# EAGLE design czujnik smrodu esp v02 (EAGLE 8.6.0)
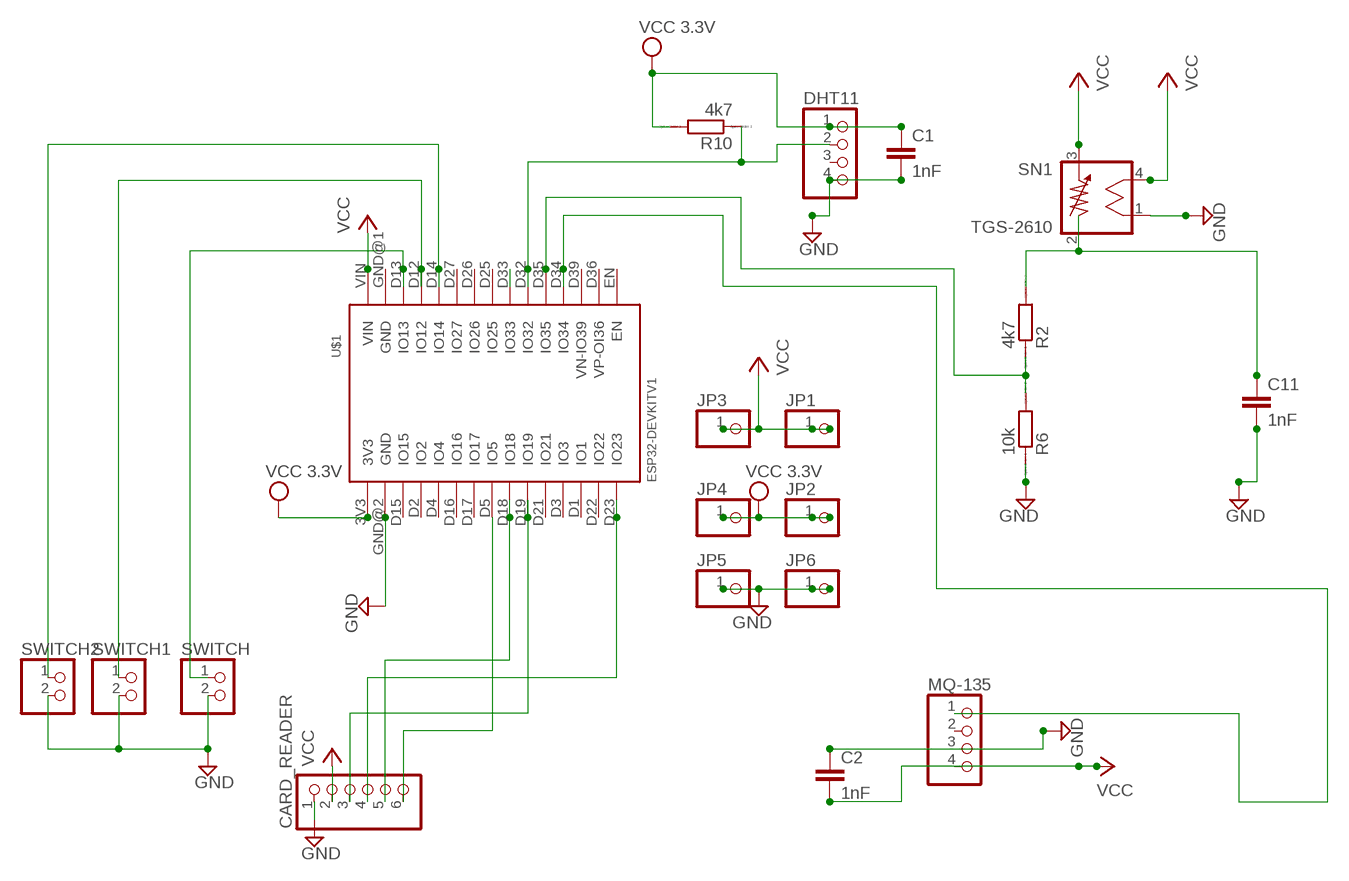
[diagram p0: schematic, sheet 1]

## Parts
C1  1nF  C2,5-3  [C2.5-3]
C2  1nF  C2,5-3  [C2.5-3]
C11  1nF  C2,5-3  [C2.5-3]
CARD_READER  PINHD-1X6  [1X06]
DHT11  PINHD-1X4  [1X04]
JP1  PINHD-1X1  [1X01]
JP2  PINHD-1X1  [1X01]
JP3  PINHD-1X1  [1X01]
JP4  PINHD-1X1  [1X01]
JP5  PINHD-1X1  [1X01]
JP6  PINHD-1X1  [1X01]
MQ-135  PINHD-1X4  [1X04]
R2  4k7  R0207/10  [0207/10]
R6  10k  R0207/10  [0207/10]
R10  4k7  R0207/10  [0207/10]
SN1  TGS-2610  [TGS-2610]
SWITCH  PINHD-1X2  [1X02]
SWITCH1  PINHD-1X2  [1X02]
SWITCH2  PINHD-1X2  [1X02]
U$1  ESP32DEVKITV1  [ESP32-DEVKITV1]

## Nets
CS: CARD_READER.6 U$1.D5(IO5)
GND: C1.2 C2.1 C11.2 CARD_READER.1 DHT11.4 JP5.1 JP6.1 MQ-135.3 R6.1 SN1.1 SWITCH1.2 SWITCH2.2 SWITCH.2 U$1.GND@2(GND)
MQ135_AIN: MQ-135.1 U$1.D34(IO34)
N$3: SWITCH1.1 U$1.D12(IO12)
N$4: R2.1 R6.2 U$1.D35(IO35)
N$5: SWITCH.1 U$1.D13(IO13)
N$10: U$1.D33(IO33)
N$14: CARD_READER.3 U$1.D19(IO19)
N$15: CARD_READER.4 U$1.D23(IO23)
N$16: DHT11.2 R10.1 U$1.D32(IO32)
N$17: CARD_READER.5 U$1.D18(IO18)
TGS2603_AIN: C11.1 R2.2 SN1.2
TX: SWITCH2.1 U$1.D14(IO14)
VCC: C1.1 C2.2 CARD_READER.2 DHT11.1 JP1.1 JP2.1 JP3.1 JP4.1 MQ-135.4 R10.2 SN1.3 SN1.4 U$1.3V3 U$1.VIN ; supply symbol labelled VCC 3.3V
Unconnected: DHT11.3 MQ-135.2 U$1.D1(IO1) U$1.D2(IO2) U$1.D3(IO3) U$1.D4(IO4) U$1.D15(IO15) U$1.D16(IO16) U$1.D17(IO17) U$1.D21(IO21) U$1.D22(IO22) U$1.D25(IO25) U$1.D26(IO26) U$1.D27(IO27) U$1.D36(VP-OI36) U$1.D39(VN-IO39) U$1.EN U$1.GND@1(GND)

## Library data of the parts
C1 C2 C11 = capacitor-wima:C: CAPACITOR naming: grid - package width
CARD_READER = pinhead:PINHD-1X6: PIN HEADER
DHT11 MQ-135 = pinhead:PINHD-1X4: PIN HEADER
JP1-JP6 = pinhead:PINHD-1X1: PIN HEADER
R2 R6 R10 = eagle-ltspice:R: RESISTOR, European symbol; SPICEMODEL: NONE; SPICEPREFIX: R
SN1 = figaro:TGS-2610: SENSOR TGS 2610 - Gas Sensor
SWITCH SWITCH1 SWITCH2 = pinhead:PINHD-1X2: PIN HEADER
U$1 = ESP32-DEVKITV1:ESP32DEVKITV1

## Board
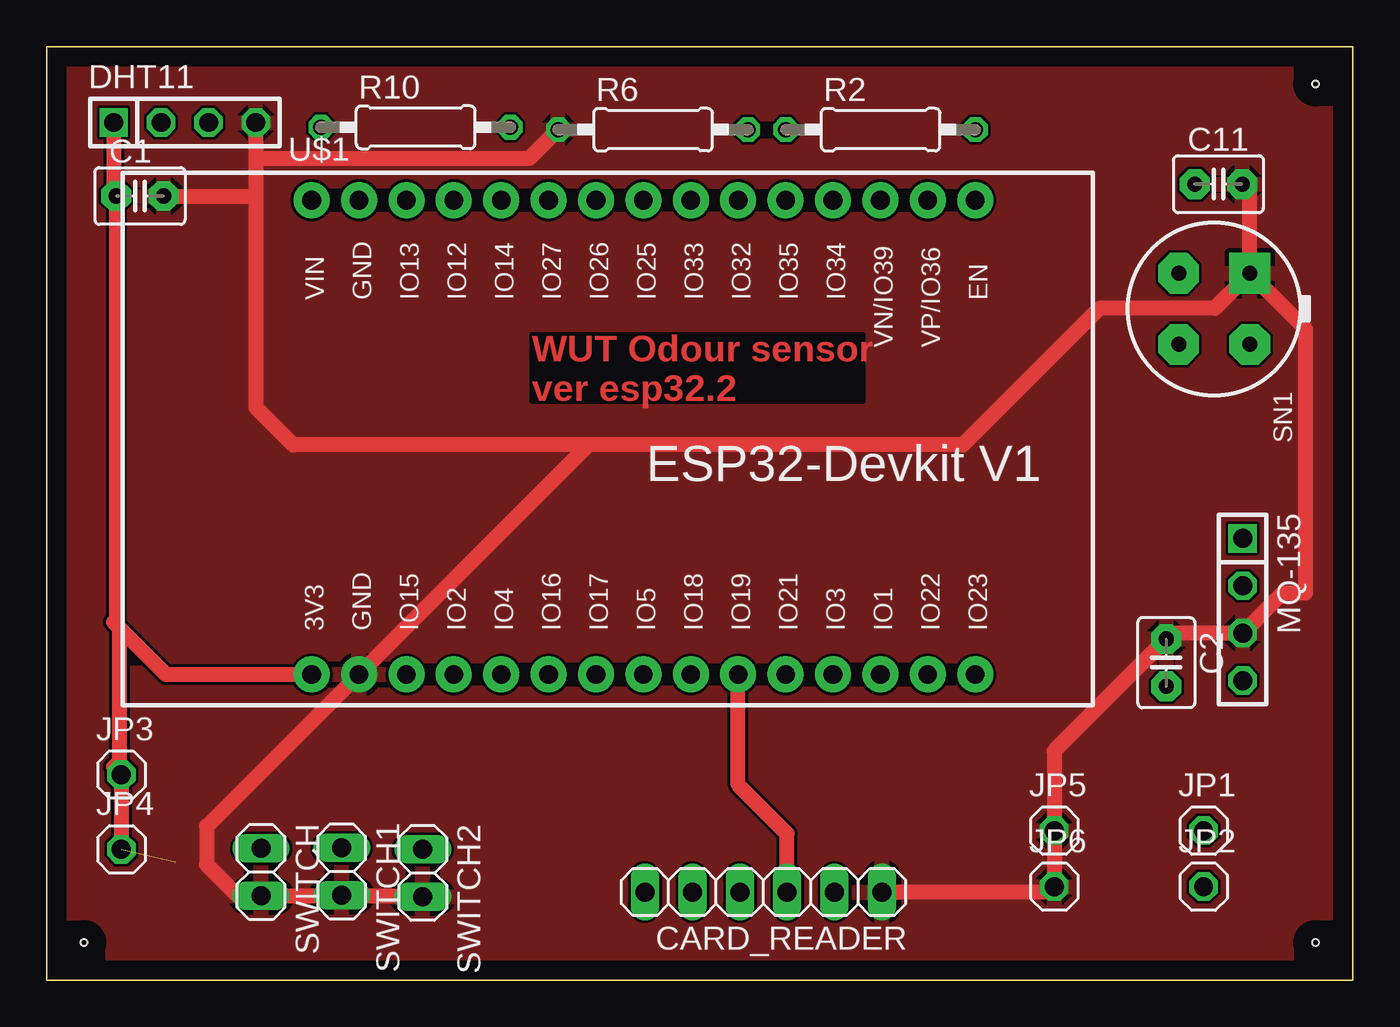
[diagram p1: board, top side]
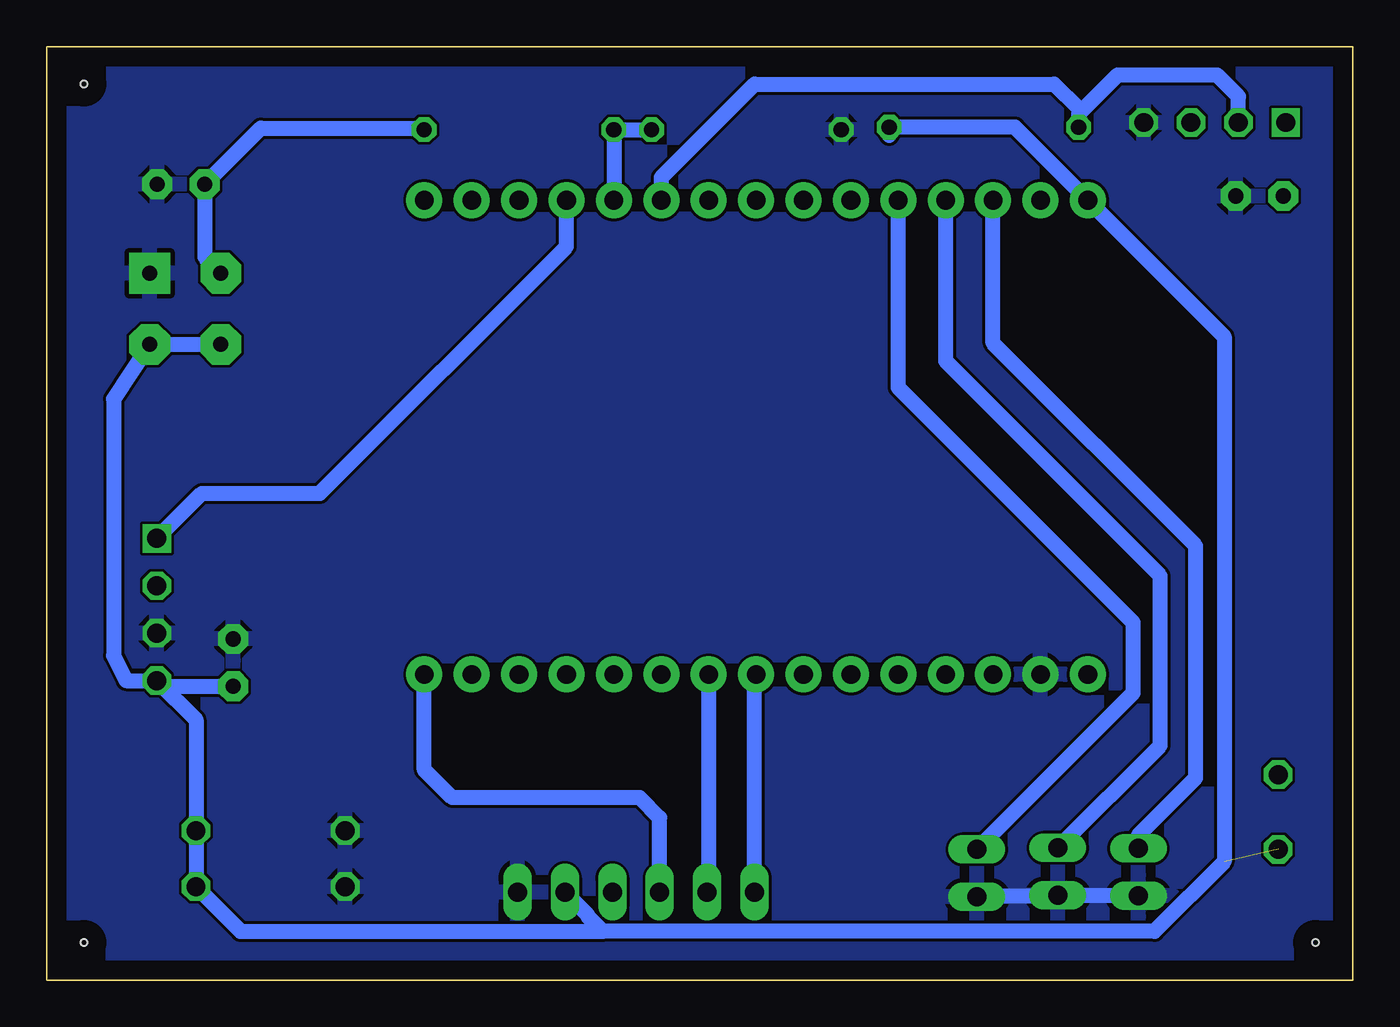
[diagram p2: board, bottom side, seen from below]

Size 70 x 50 mm. Coordinates in mm from the lower left corner, seen from the top.
Outline: 0,50 70,50 70,0 0,0 0,50
Copper layers (1*16): Top 0.035mm / dielectric 1.5mm / Bottom 0.035mm
Design rules "default": minimum track width 6mil, minimum drill 0.35mm, track to track 6mil, track to pad 6mil, pad to pad 6mil, via to via 6mil, smd to smd 6mil, copper to edge 40mil, drill to drill 6mil, minimum pad ring 10mil, minimum via ring 8mil, stop-mask expansion 4mil, vias tented up to drill 0mil, thermal gap 10mil
Holes 0.35 mm at 68,48 68,2 2,2

### Footprints (pad centres in the part's own frame; a part is rotated, then mirrored left to right if it is on the bottom)
C2.5-3 = drill 0.813 pad 1.6 octagon: 1 -1.27,0; 2 1.27,0
1X06 = drill 1.016 long: 1 -6.35,0; 2 -3.81,0; 3 -1.27,0; 4 1.27,0; 5 3.81,0; 6 6.35,0
1X04 = drill 1.016 square: 1 -3.81,0 | drill 1.016 octagon: 2 -1.27,0; 3 1.27,0; 4 3.81,0
1X01 = drill 1.016 octagon: 1 0,0
0207/10 = drill 0.813 octagon: 1 -5.08,0; 2 5.08,0
TGS-2610 = drill 0.813 pad 2.184 square: 1 -1.905,1.905 | drill 0.813 pad 2.184 octagon: 2 -1.905,-1.905; 3 1.905,-1.905; 4 1.905,1.905
1X02 = drill 1.016 long: 1 -1.27,0; 2 1.27,0
ESP32-DEVKITV1 = drill 1 pad 1.93: 3V3 -16.52,-12.27; D1 13.96,-12.27; D2 -8.9,-12.27; D3 11.42,-12.27; D4 -6.36,-12.27; D5 1.26,-12.27; D12 -8.9,13.135; D13 -11.44,13.135; D14 -6.36,13.135; D15 -11.44,-12.27; D16 -3.82,-12.27; D17 -1.28,-12.27; D18 3.8,-12.27; D19 6.34,-12.27; D21 8.88,-12.27; D22 16.5,-12.27; D23 19.04,-12.27; D25 1.26,13.135; D26 -1.28,13.135; D27 -3.82,13.135; D32 6.34,13.135; D33 3.8,13.135; D34 11.42,13.135; D35 8.88,13.135; D36 16.5,13.135; D39 13.96,13.135; EN 19.04,13.135; GND@1 -13.98,13.135; GND@2 -13.98,-12.27; VIN -16.52,13.135

### Placement (x,y rotation side)
C1  5,42 0 top
C2  60,17 270 top
C11  62.8,42.63 0 top
CARD_READER  38.42,4.71 180 top
DHT11  7.4,45.94 0 top
JP1  62,8 0 top
JP2  62,5 0 top
JP3  4,11 0 top
JP4  4,7 0 top
JP5  54,8 0 top
JP6  54,5 0 top
MQ-135  64.1,19.85 270 top
R2  44.69,45.56 0 top
R6  32.5,45.56 0 top
R10  19.77,45.68 0 top
SN1  62.57,35.96 270 top
SWITCH  11.49,5.78 270 top
SWITCH1  15.81,5.81 270 top
SWITCH2  20.15,5.73 270 top
U$1  30.72,28.64 0 top

### Tracks (layer width: path | path; a pad name or v marks a point on that pad's centre or on a via)
CS
  Bottom 0.813: CARD_READER.6 32.07,16.28 U$1.D5
GND
  Top 0.813: SN1.1 62.6,35.98 56.42,35.98 49.11,28.66 29.03,28.66 | 29.03,28.66 13.22,28.66 11.21,30.67 11.21,42 | DHT11.4 11.21,44 | 11.21,44 11.21,42 | SN1.1 67.47,34.86 67.47,20.74 66.25,20.74 MQ-135.3 60.31,18.58 C2.1 54,12.27 JP5.1 JP6.1 53.71,4.71 CARD_READER.1 | SWITCH2.2 20.1,4.51 SWITCH.2 10.25,4.51 8.57,6.19 8.57,8.24 8.61,8.24 U$1.GND@2 29.03,28.66 | C1.2 11.21,42 | SN1.1 64.48,42.23 C11.2 | R6.1 25.86,44 11.21,44
  Bottom 0.813: SWITCH.2 15.84,4.51 | 15.84,4.51 SWITCH1.2 | SWITCH2.2 20.1,4.51 15.84,4.51
  pour Top: 1,49 1,1 69,1 69,48 69,49
  pour Bottom: 1,49 1,1 69,1 69,49
MQ135_AIN
  Bottom 0.813: MQ-135.1 61.68,26.08 55.36,26.08 42.14,39.29 U$1.D34
N$3
  Bottom 0.813: SWITCH1.1 10.32,12.56 10.32,21.66 21.82,33.15 U$1.D12
N$4
  Bottom 0.813: R6.2 R2.1 39.6,45.55 U$1.D35
N$5
  Bottom 0.813: SWITCH.1 11.49,7.76 8.42,10.84 8.42,23.26 19.28,34.12 U$1.D13
N$14
  Top 0.813: CARD_READER.3 39.69,7.84 37.06,10.46 U$1.D19
N$15
  Bottom 0.813: CARD_READER.4 37.15,8.7 38.21,9.77 48.27,9.77 49.76,11.26 U$1.D23
N$16
  Bottom 0.813: DHT11.2 6.13,47.33 7.28,48.48 12.61,48.48 14.69,46.4 | 14.69,46.4 R10.1 14.69,46.37 | U$1.D32 37.06,43 32.06,48 16,48 14.69,46.69 14.69,46.4
N$17
  Bottom 0.813: U$1.D18 34.52,4.8 CARD_READER.5
TGS2603_AIN
  Bottom 0.813: R2.2 49.85,45.63 58.53,45.63 C11.1 61.53,38.72 SN1.2
TX
  Bottom 0.813: SWITCH2.1 11.77,15.38 11.77,19.14 24.36,31.73 U$1.D14
VCC  (1 unrouted)
  Top 0.813: U$1.3V3 6.39,16.37 3.88,18.88 | 3.88,18.88 3.59,19.17 3.73,19.3 C1.1 3.59,42.14 DHT11.1 | JP4.1 JP3.1 3.59,11.41 3.88,11.69 3.88,18.88
  Bottom 0.813: SN1.3 SN1.4 66.41,31.13 66.41,17.39 65.75,16.04 MQ-135.4 | 24.85,45.25 R10.2 18.11,45.68 U$1.VIN 6.89,34.47 6.89,6.34 10.63,2.61 40.21,2.61 | CARD_READER.2 41.01,3.49 41.01,3.4 40.21,2.61 | MQ-135.4 62,13.95 JP1.1 JP2.1 59.61,2.61 40.21,2.61 | MQ-135.4 63.78,15.73 C2.2

### Text on the board
Top: WUT Odour sensor / ver esp32.2